# Altium schematic sheet Sheet1.SchDoc
size A2
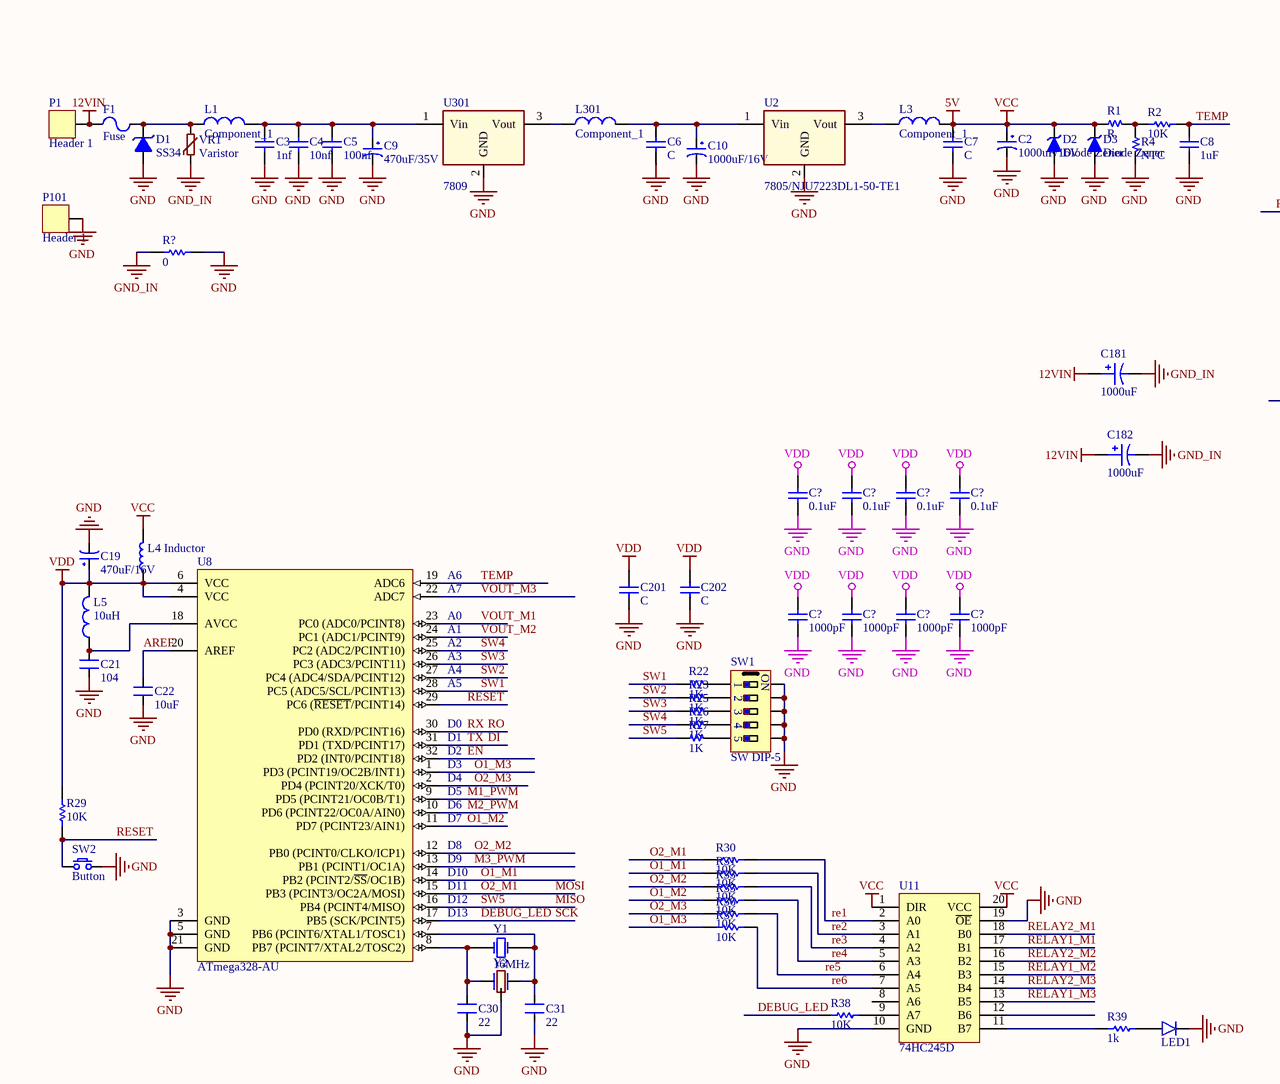
[diagram p0: Sheet1.SchDoc, top left]
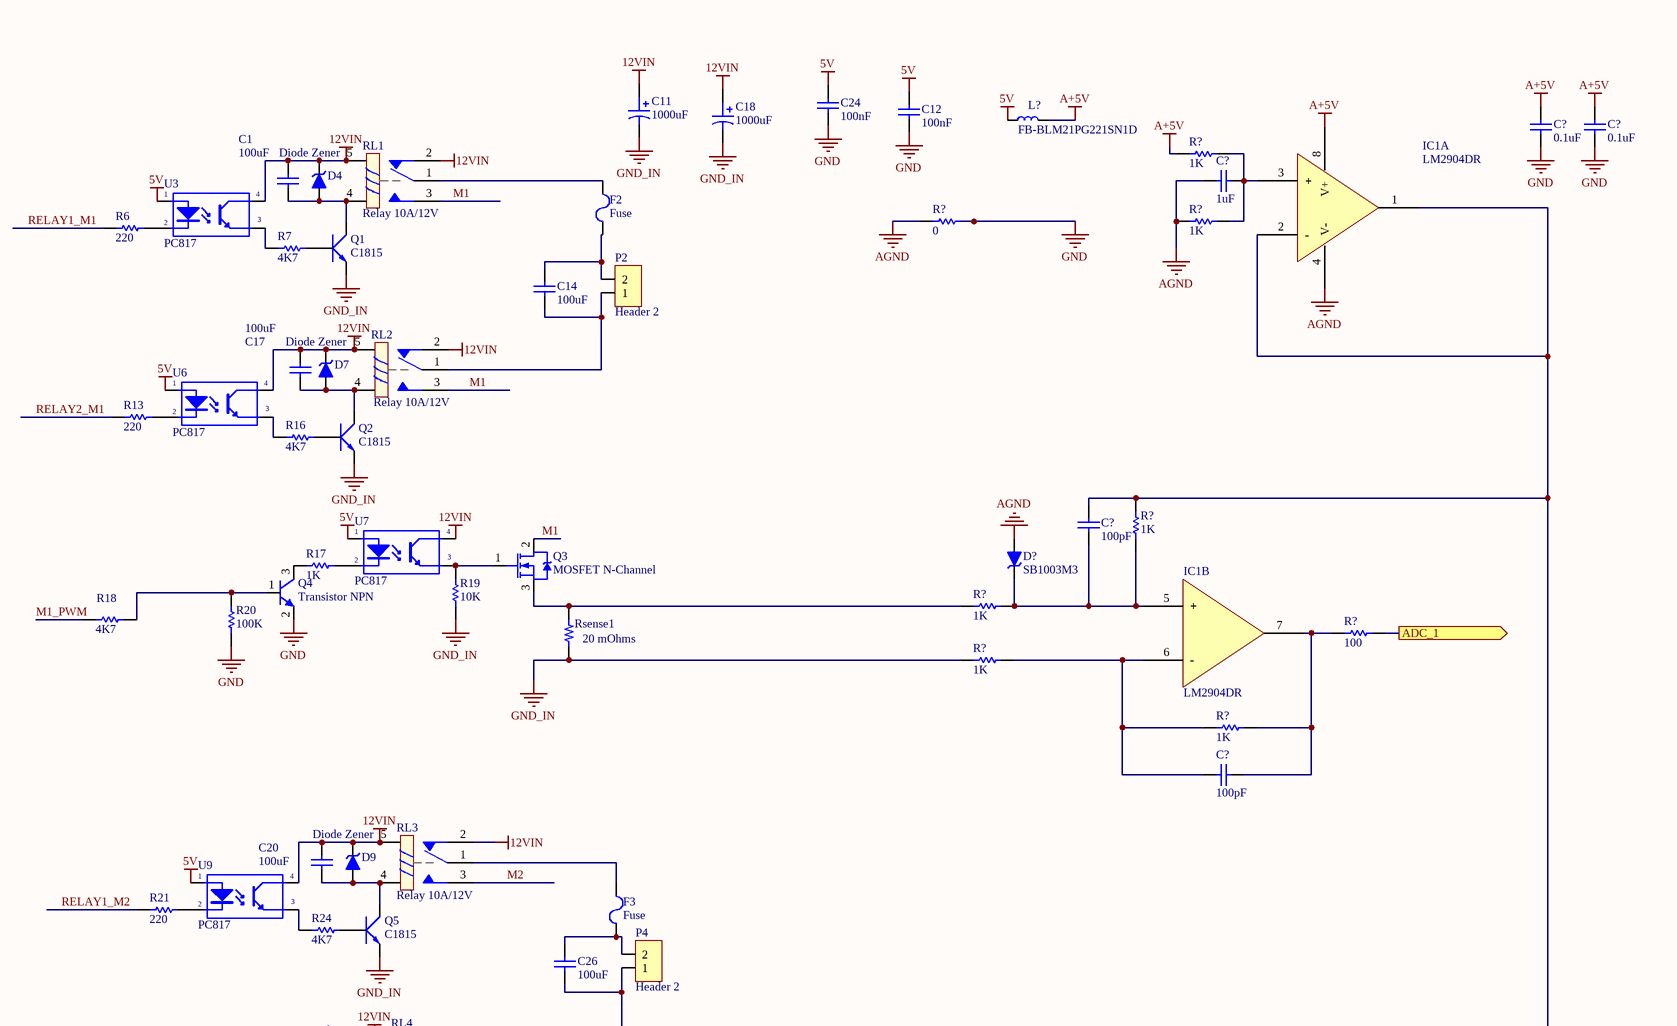
[diagram p1: Sheet1.SchDoc, top right]
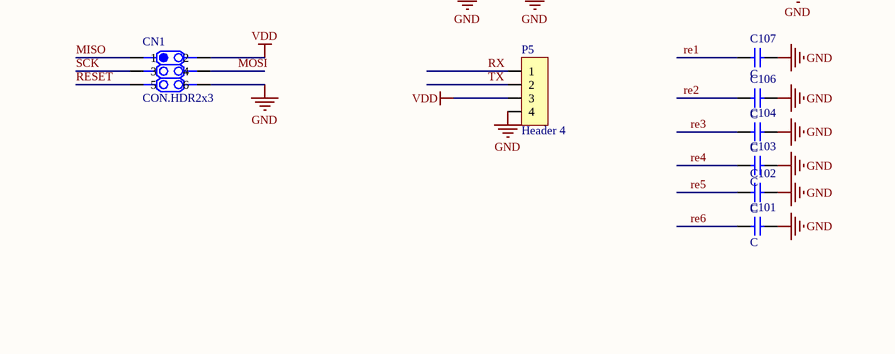
[diagram p2: Sheet1.SchDoc, bottom left]
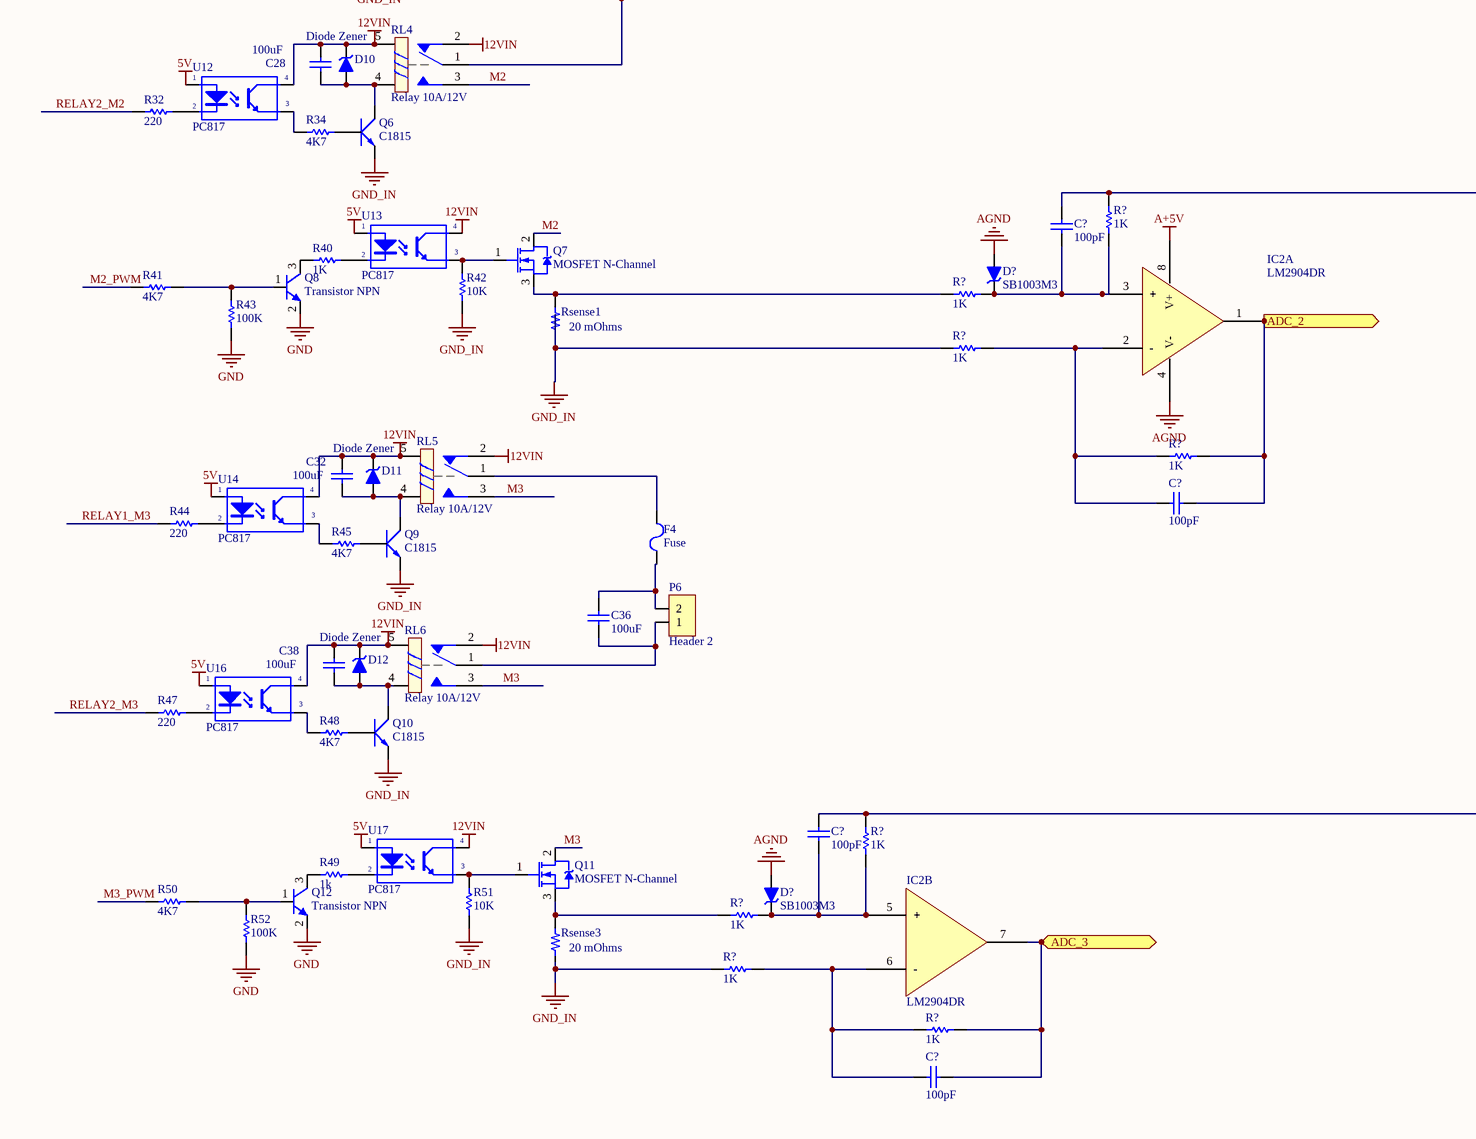
[diagram p3: Sheet1.SchDoc, bottom right]

## Parts
(Parts that share a designator on the sheet are numbered #1, #2 ... from top to bottom, then left to right.)
C1  value 100uF  [C 0805 (2012)]  (hidden comment: Cap Non-pol)
C2  1000uF/16V  [WCAP-PSHP 8x8.7x3.1]
C3  1nf  [C 0805 (2012)]
C4  10nf  [C 0805 (2012)]
C5  100nf  [C 0805 (2012)]
C6  C  [C 0805 (2012)]
C7  C  [C 0805 (2012)]
C8  1uF  [C 0805 (2012)]
C9  470uF/35V  [WCAP-PSHP 8x8.7x3.1]
C10  1000uF/16V  [WCAP-PSHP 8x8.7x3.1]
C11  value 1000uF  [RADIAL E]  (hidden comment: Cap Pol)
C12  value 100nF  [C 0805 (2012)]  (hidden comment: Cap Non-pol)
C14  value 100uF  [Cap Non-Pol 5mm]  (hidden comment: Cap Non-pol)
C17  value 100uF  [C 0805 (2012)]  (hidden comment: Cap Non-pol)
C18  value 1000uF  [RADIAL E]  (hidden comment: Cap Pol)
C19  470uF/16V  [WCAP-PSHP 8x8.7x3.1]
C20  value 100uF  [C 0805 (2012)]  (hidden comment: Cap Non-pol)
C21  104  [R 0805 (2012)]
C22  10uF  [R 0805 (2012)]
C24  value 100nF  [C 0805 (2012)]  (hidden comment: Cap Non-pol)
C26  value 100uF  [Cap Non-Pol 5mm]  (hidden comment: Cap Non-pol)
C28  value 100uF  [C 0805 (2012)]  (hidden comment: Cap Non-pol)
C30  22  [C 0805 (2012)]
C31  22  [C 0805 (2012)]
C32  value 100uF  [C 0805 (2012)]  (hidden comment: Cap Non-pol)
C36  value 100uF  [Cap Non-Pol 5mm]  (hidden comment: Cap Non-pol)
C38  value 100uF  [C 0805 (2012)]  (hidden comment: Cap Non-pol)
C101  C  [C 0805]
C102  C  [C 0805]
C103  C  [C 0805]
C104  C  [C 0805]
C106  C  [C 0805]
C107  C  [C 0805]
C181  value 1000uF  [RADIAL E]  (hidden comment: Cap Pol)
C182  value 1000uF  [RADIAL E]  (hidden comment: Cap Pol)
C201  C  [C 0805 (2012)]
C202  C  [C 0805 (2012)]
C?#1  value 0.1uF  [C 0805 (2012)]  (hidden comment: Cap Non-pol)
C?#2  value 0.1uF  [C 0805 (2012)]  (hidden comment: Cap Non-pol)
C?#3  value 1uF  [C 0805 (2012)]  (hidden comment: Cap Non-pol)
C?#4  0.1uF  [C 0603]
C?#5  0.1uF  [C 0603]
C?#6  0.1uF  [C 0603]
C?#7  0.1uF  [C 0603]
C?#8  value 100pF  [C 0805 (2012)]  (hidden comment: Cap Non-pol)
C?#9  1000pF  [C 0603]
C?#10  1000pF  [C 0603]
C?#11  1000pF  [C 0603]
C?#12  1000pF  [C 0603]
C?#13  value 100pF  [C 0805 (2012)]  (hidden comment: Cap Non-pol)
C?#14  value 100pF  [C 0805 (2012)]  (hidden comment: Cap Non-pol)
C?#15  value 100pF  [C 0805 (2012)]  (hidden comment: Cap Non-pol)
C?#16  value 100pF  [C 0805 (2012)]  (hidden comment: Cap Non-pol)
C?#17  value 100pF  [C 0805 (2012)]  (hidden comment: Cap Non-pol)
CN1  CON.HDR2x3  [Header 3x2]
D1  SS34  [DO-214AC (SMA)]
D2  Diode Zener  [SOD-80]
D3  Diode Zener  [SOD-80]
D4  Diode Zener  [SOD-80]
D7  Diode Zener  [SOD-80]
D9  Diode Zener  [SOD-80]
D10  Diode Zener  [SOD-80]
D11  Diode Zener  [SOD-80]
D12  Diode Zener  [SOD-80]
D?#1  SB1003M3  [DO-214AC (SMA)]
D?#2  SB1003M3  [DO-214AC (SMA)]
D?#3  SB1003M3  [DO-214AC (SMA)]
F1  Fuse  [FUSE 4 DIP]
F2  Fuse  [FUSE 4 DIP]
F3  Fuse  [FUSE 4 DIP]
F4  Fuse  [FUSE 4 DIP]
IC1  LM2904DR  [TI SOIC-8 D]  (parts A,B of 2)
IC2  LM2904DR  [TI SOIC-8 D]  (parts A,B of 2)
L1  Component_1  [1210]
L3  Component_1  [1210]
L4  Inductor  [Inductor SMD 4.8x4.8]
L5  10uH  [R 0805 (2012)]
L301  Component_1  [1210]
L?  FB-BLM21PG221SN1D  [L 0805 (2012)]
LED1  Led  [Led SMD 0805]  (value not drawn)
P1  Header 1  [HDR/Terminal/1/copper/8.8]
P2  Header 2  [HDR Domino 2]
P4  Header 2  [HDR Domino 2]
P5  Header 4  [Header 4]
P6  Header 2  [HDR Domino 2]
P101  Header 1  [HDR/Terminal/1/copper/8.8]
Q1  C1815  [SOT23B]
Q2  C1815  [SOT23B]
Q3  MOSFET N-Channel  [TO-252 (DPAK)]
Q4  Transistor NPN  [SOT-23]
Q5  C1815  [SOT23B]
Q6  C1815  [SOT23B]
Q7  MOSFET N-Channel  [TO-252 (DPAK)]
Q8  Transistor NPN  [SOT-23]
Q9  C1815  [SOT23B]
Q10  C1815  [SOT23B]
Q11  MOSFET N-Channel  [TO-252 (DPAK)]
Q12  Transistor NPN  [SOT-23]
R1  R  [R 0805]
R2  10K  [R 0805 (2012)]
R4  NTC  [R 1/4W/300]
R6  220  [R 0805 (2012)]
R7  4K7  [R 0805 (2012)]
R13  220  [R 0805 (2012)]
R16  4K7  [R 0805 (2012)]
R17  1K  [R 0805 (2012)]
R18  4K7  [R 0805 (2012)]
R19  10K  [R 0805 (2012)]
R20  100K  [R 0805 (2012)]
R21  220  [R 0805 (2012)]
R22  1K  [R 0805]
R23  1K  [R 0805]
R24  4K7  [R 0805 (2012)]
R25  1K  [R 0805]
R26  1K  [R 0805]
R27  1K  [R 0805]
R29  10K  [R 0805 (2012)]
R30  10K  [R 0805 (2012)]
R31  10K  [R 0805 (2012)]
R32  220  [R 0805 (2012)]
R33  10K  [R 0805 (2012)]
R34  4K7  [R 0805 (2012)]
R35  10K  [R 0805 (2012)]
R36  10K  [R 0805 (2012)]
R37  10K  [R 0805 (2012)]
R38  10K  [R 0805 (2012)]
R39  1k  [R 0805 (2012)]
R40  1K  [R 0805 (2012)]
R41  4K7  [R 0805 (2012)]
R42  10K  [R 0805 (2012)]
R43  100K  [R 0805 (2012)]
R44  220  [R 0805 (2012)]
R45  4K7  [R 0805 (2012)]
R47  220  [R 0805 (2012)]
R48  4K7  [R 0805 (2012)]
R49  1k  [R 0805 (2012)]
R50  4K7  [R 0805 (2012)]
R51  10K  [R 0805 (2012)]
R52  100K  [R 0805 (2012)]
R?#1  1K  [R 0805 (2012)]
R?#2  0  [R 0805 (2012)]
R?#3  1K  [R 0805 (2012)]
R?#4  0  [R 0805 (2012)]
R?#5  1K  [R 0805 (2012)]
R?#6  1K  [R 0805 (2012)]
R?#7  100  [R 0805 (2012)]
R?#8  1K  [R 0805 (2012)]
R?#9  1K  [R 0805 (2012)]
R?#10  1K  [R 0805 (2012)]
R?#11  1K  [R 0805 (2012)]
R?#12  1K  [R 0805 (2012)]
R?#13  1K  [R 0805 (2012)]
R?#14  1K  [R 0805 (2012)]
R?#15  1K  [R 0805 (2012)]
R?#16  1K  [R 0805 (2012)]
R?#17  1K  [R 0805 (2012)]
RL1  Relay 10A/12V  [RL_SPDT_10A]
RL2  Relay 10A/12V  [RL_SPDT_10A]
RL3  Relay 10A/12V  [RL_SPDT_10A]
RL4  Relay 10A/12V  [RL_SPDT_10A]
RL5  Relay 10A/12V  [RL_SPDT_10A]
RL6  Relay 10A/12V  [RL_SPDT_10A]
Rsense1#1  20 mOhms  [VISHAY WSHP2818]
Rsense1#2  20 mOhms  [VISHAY WSHP2818]
Rsense3  20 mOhms  [VISHAY WSHP2818]
SW1  SW DIP-5  [SW/DIP5/300]
SW2  Button  [SW/2/SMD]
U2  7805/NJU7223DL1-50-TE1  [TO-252 (DPAK)]
U3  PC817  [SOP4 - PC817]
U6  PC817  [SOP4 - PC817]
U7  PC817  [SOP4 - PC817]
U8  ATmega328-AU  [QFP32N]
U9  PC817  [SOP4 - PC817]
U11  74HC245D  [SOIC-20]
U12  PC817  [SOP4 - PC817]
U13  PC817  [SOP4 - PC817]
U14  PC817  [SOP4 - PC817]
U16  PC817  [SOP4 - PC817]
U17  PC817  [SOP4 - PC817]
U301  7809  [TO-252 (DPAK)]
VR1  Varistor  [VARISTOR DISC 5MM/7MM]
Y1  16MHz  [XTAL]
Y2  (no value)  [Crystal SMD CSTCE]

## Ports
ADC_1 (out), ADC_2 (out), ADC_3 (out)

## Nets
5V: C2.1 C7.1 C12.2 C24.2 D2.2(K) D3.2(K) L3.2 L4.2 L?.1 R1.1 U3.1(A) U6.1(A) U7.1(A) U9.1(A) U11.1(DIR) U11.20(VCC) U12.1(A) U13.1(A) U14.1(A) U16.1(A) U17.1(A)  [also labelled VCC]
12VIN: C1.2 C11.1 C17.2 C18.1 C20.2 C28.2 C32.2 C38.2 C181.1 C182.1 D4.2(K) D7.2(K) D9.2(K) D10.2(K) D11.2(K) D12.2(K) F1.1 P1.1 RL1.2 RL1.5 RL2.2 RL2.5 RL3.2 RL3.5 RL4.2 RL4.5 RL5.2 RL5.5 RL6.2 RL6.5 U3.4(C) U6.4(C) U7.4(C) U9.4(C) U12.4(C) U13.4(C) U14.4(C) U16.4(C) U17.4(C)
A+5V: C?#1.2 C?#2.2 IC1.8(V+) IC2.8(V+) L?.2 R?#1.1
AGND: C?#3.2 D?#1.1(A) D?#2.1(A) D?#3.1(A) IC1.4(V-) IC2.4(V-) R?#2.1 R?#3.1
GND: C2.2 C3.2 C4.2 C5.2 C6.2 C7.2 C8.2 C9.2 C10.2 C12.1 C19.2 C21.1 C22.1 C24.1 C30.1 C31.1 C101.2 C102.2 C103.2 C104.2 C106.2 C107.2 C201.2 C202.2 C?#1.1 C?#2.1 C?#4.2 C?#5.2 C?#6.2 C?#7.2 C?#9.2 C?#10.2 C?#11.2 C?#12.2 CN1.6 D1.1(A) D2.1(A) D3.1(A) LED1.2(K) P5.4 P101.1 Q4.2(E) Q8.2(E) Q12.2(E) R4.2 R20.1 R43.1 R52.1 R?#2.2 R?#4.1 SW1.6 SW1.7 SW1.8 SW1.9 SW1.10 SW2.2 U2.2(GND) U8.3(GND) U8.5(GND) U8.21(GND) U11.10(GND) U11.19(~{OE}) U301.2(GND) Y2.2
GND_IN: C11.2 C18.2 C181.2 C182.2 Q1.1(E) Q2.1(E) Q5.1(E) Q6.1(E) Q9.1(E) Q10.1(E) R19.1 R42.2 R51.2 R?#4.2 R?#8.2 R?#12.2 R?#16.2 Rsense1#1.1 Rsense1#2.1 Rsense3.1 VR1.2
VDD: C19.1 C201.1 C202.1 C?#4.1 C?#5.1 C?#6.1 C?#7.1 C?#9.1 C?#10.1 C?#11.1 C?#12.1 CN1.2 L4.1 L5.2 P5.3 R29.2 U8.4(VCC) U8.6(VCC)
ADC_1: R?#7.1 ; port ADC_1
ADC_2: C?#15.1 IC2.1(OUTA) R?#13.1 ; port ADC_2
ADC_3: C?#17.1 IC2.7(OUTB) R?#17.1 ; port ADC_3
AREF: C22.2 U8.20(AREF)
DEBUG_LED: CN1.3 R38.1 U8.17(PB5_(SCK/PCINT5))  [also labelled SCK]
DI: P5.2 U8.31(PD1_(TXD/PCINT17))  [also labelled TX]
EN: U8.32(PD2_(INT0/PCINT18))
M1: Q3.2(D) RL1.3 RL2.3
M1_PWM: R18.2 U8.9(PD5_(PCINT21/OC0B/T1))
M2: Q7.2(D) RL3.3 RL4.3
M2_PWM: R41.2 U8.10(PD6_(PCINT22/OC0A/AIN0))
M3: Q11.2(D) RL5.3 RL6.3
M3_PWM: R50.2 U8.13(PB1_(PCINT1/OC1A))
MISO: CN1.1 R27.1 U8.16(PB4_(PCINT4/MISO))  [also labelled SW5]
MOSI: CN1.4 R30.1 U8.15(PB3_(PCINT3/OC2A/MOSI))  [also labelled O2_M1]
O1_M1: R31.1 U8.14(PB2_(PCINT2/~{SS}/OC1B))
O1_M2: R35.1 U8.11(PD7_(PCINT23/AIN1))
O1_M3: R37.1 U8.1(PD3_(PCINT19/OC2B/INT1))
O2_M2: R33.1 U8.12(PB0_(PCINT0/CLKO/ICP1))
O2_M3: R36.1 U8.2(PD4_(PCINT20/XCK/T0))
re1: C107.1 R30.2 U11.2(A0)
re2: C106.1 R31.2 U11.3(A1)
re3: C104.1 R33.2 U11.4(A2)
re4: C103.1 R35.2 U11.5(A3)
re5: C102.1 R36.2 U11.6(A4)
re6: C101.1 R37.2 U11.7(A5)
RELAY1_M1: R6.2 U11.17(B1)
RELAY1_M2: R21.2 U11.15(B3)
RELAY1_M3: R44.2 U11.13(B5)
RELAY2_M1: R13.2 U11.18(B0)
RELAY2_M2: R32.2 U11.16(B2)
RELAY2_M3: R47.2 U11.14(B4)
RESET: CN1.5 R29.1 SW2.1 U8.29(PC6_(~{RESET}/PCINT14))
RO: P5.1 U8.30(PD0_(RXD/PCINT16))  [also labelled RX]
SW1: R22.1 U8.28(PC5_(ADC5/SCL/PCINT13))
SW2: R23.1 U8.27(PC4_(ADC4/SDA/PCINT12))
SW3: R25.1 U8.26(PC3_(ADC3/PCINT11))
SW4: R26.1 U8.25(PC2_(ADC2/PCINT10))
TEMP: C8.1 R2.2 U8.19(ADC6)
VOUT_M1: U8.23(PC0_(ADC0/PCINT8))
VOUT_M2: U8.24(PC1_(ADC1/PCINT9))
VOUT_M3: U8.22(ADC7)
NetC1_1: C1.1 D4.1(A) Q1.2(C) RL1.4
NetC3_1: C3.1 C4.1 C5.1 C9.1 L1.2 U301.1(Vin)
NetC6_1: C6.1 C10.1 L301.2 U2.1(Vin)
NetC14_1: C14.1 P2.1 RL2.1
NetC14_2: C14.2 F2.1 P2.2
NetC17_1: C17.1 D7.1(A) Q2.2(C) RL2.4
NetC20_1: C20.1 D9.1(A) Q5.2(C) RL3.4
NetC21_2: C21.2 L5.1 U8.18(AVCC)
NetC26_1: C26.1 P4.1 RL4.1
NetC26_2: C26.2 F3.1 P4.2
NetC28_1: C28.1 D10.1(A) Q6.2(C) RL4.4
NetC30_2: C30.2 U8.8(PB7_(PCINT7/XTAL2/TOSC2)) Y1.1(OSC1) Y2.3
NetC31_2: C31.2 U8.7(PB6_(PCINT6/XTAL1/TOSC1)) Y1.2(OSC2) Y2.1
NetC32_1: C32.1 D11.1(A) Q9.2(C) RL5.4
NetC36_1: C36.1 P6.1 RL6.1
NetC36_2: C36.2 F4.1 P6.2
NetC38_1: C38.1 D12.1(A) Q10.2(C) RL6.4
NetC?#3_1: C?#3.1 IC1.3(+) R?#1.2 R?#3.2
NetC?#8_1: C?#8.1 C?#14.1 C?#16.1 IC1.1(OUTA) IC1.2(-) R?#5.1 R?#10.1 R?#14.1
NetC?#8_2: C?#8.2 D?#1.2(K) IC1.5(+) R?#5.2 R?#6.1
NetC?#13_1: C?#13.1 IC1.7(OUTB) R?#7.2 R?#9.1
NetC?#13_2: C?#13.2 IC1.6(-) R?#8.1 R?#9.2
NetC?#14_2: C?#14.2 D?#2.2(K) IC2.3(+) R?#10.2 R?#11.1
NetC?#15_2: C?#15.2 IC2.2(-) R?#12.1 R?#13.2
NetC?#16_2: C?#16.2 D?#3.2(K) IC2.5(+) R?#14.2 R?#15.1
NetC?#17_2: C?#17.2 IC2.6(-) R?#16.1 R?#17.2
NetD1_2: D1.2(K) F1.2 L1.1 VR1.1
NetF2_2: F2.2 RL1.1
NetF3_2: F3.2 RL3.1
NetF4_2: F4.2 RL5.1
NetL3_1: L3.1 U2.3(Vout)
NetL301_1: L301.1 U301.3(Vout)
NetLED1_1: LED1.1(A) R39.2
NetQ1_3: Q1.3(B) R7.2
NetQ2_3: Q2.3(B) R16.2
NetQ3_1: Q3.1(G) R19.2 U7.3(E)
NetQ3_3: Q3.3(S) R?#6.2 Rsense1#1.2
NetQ4_1: Q4.1(B) R18.1 R20.2
NetQ4_3: Q4.3(C) R17.1
NetQ5_3: Q5.3(B) R24.2
NetQ6_3: Q6.3(B) R34.2
NetQ7_1: Q7.1(G) R42.1 U13.3(E)
NetQ7_3: Q7.3(S) R?#11.2 Rsense1#2.2
NetQ8_1: Q8.1(B) R41.1 R43.2
NetQ8_3: Q8.3(C) R40.1
NetQ9_3: Q9.3(B) R45.2
NetQ10_3: Q10.3(B) R48.2
NetQ11_1: Q11.1(G) R51.1 U17.3(E)
NetQ11_3: Q11.3(S) R?#15.2 Rsense3.2
NetQ12_1: Q12.1(B) R50.1 R52.2
NetQ12_3: Q12.3(C) R49.1
NetR1_2: R1.2 R2.1 R4.1
NetR6_1: R6.1 U3.2(K)
NetR7_1: R7.1 U3.3(E)
NetR13_1: R13.1 U6.2(K)
NetR16_1: R16.1 U6.3(E)
NetR17_2: R17.2 U7.2(K)
NetR21_1: R21.1 U9.2(K)
NetR22_2: R22.2 SW1.1
NetR23_2: R23.2 SW1.2
NetR24_1: R24.1 U9.3(E)
NetR25_2: R25.2 SW1.3
NetR26_2: R26.2 SW1.4
NetR27_2: R27.2 SW1.5
NetR32_1: R32.1 U12.2(K)
NetR34_1: R34.1 U12.3(E)
NetR38_2: R38.2 U11.9(A7)
NetR39_1: R39.1 U11.11(B7)
NetR40_2: R40.2 U13.2(K)
NetR44_1: R44.1 U14.2(K)
NetR45_1: R45.1 U14.3(E)
NetR47_1: R47.1 U16.2(K)
NetR48_1: R48.1 U16.3(E)
NetR49_2: R49.2 U17.2(K)

Not connected (* = marked no-connect by the designer): U11 8(A6) 12(B6)

## Notes on the sheet
- (near U8) A6
- (near U8) A7
- (near U8) A0
- (near U8) A1
- (near U8) A2
- (near U8) A3
- (near U8) A4
- (near U8) A5
- (near U8) D0
- (near U8) D2
- (near U8) D3
- (near U8) D4
- (near U8) D5
- (near U8) D1
- (near U8) D7
- (near U8) D8
- (near U8) D9
- (near U8) D6
- (near U8) D10
- (near U8) D11
- D12
- D13
- (in symbol SW DIP-5) ON

## Library data of the parts
C1 C12 C14 C17 C20 C24 C26 C28 C32 C36 C38 C?#1-C?#3 C?#8 C?#13-C?#17 = Cap Non-pol: Non-polarized Capacitor; Published: 8-Jun-2000; LatestRevisionDate: 17-Jul-2002; LatestRevisionNote: Re-released for DXP Platform.; PackageReference: RAD-0.3; Publisher: Altium Limited
C2 C10 C19 = CP4: Cap 1000uF/16V - 220uF/50V; Description 5: 4,7uF>10uF/250V_3,3uF>10uF/400V - 2,2uF>4,7uF/450V; Description 1: 2200uF-3300uF/6,3V - 1000uF-2200uF/10V; Description 2: 1000uF/16V - 470uF => 1000uF/25V - 100uF/100V; Description 3: 330uF>470uF/35V_220uF>470uF/50V_10uF>22uF/250V; Description 4: 220uF => 330uF/63V - 10uF =>33uF/160 - 200V; Value: 1000uF/16V
C3-C8 C101-C104 C106 C107 C201 C202 = Capacitor NP: Capacitor non-pol
C9 = CP3: Cap 100uF/35V - 470uF/16V; Value: 100uF/35V/50V; Description 1: 1000uF/6,3V - 470uF/16V - 330uF - 25V; Description 2: 220uF/35V - 100uF/50V - 63V - 4,7uF/200V; Description 3: 22uF => 33uF100V - 3,3uF => 4,7uF/250V; Description 4: 2,2uF =>3,3uF/350 - 2,2uF/400V - 1uF/450V
C11 C18 C181 C182 = Cap Pol: Polarized Capacitor; Published: 8-Jun-2000; LatestRevisionDate: 17-Jul-2002; LatestRevisionNote: Re-released for DXP Platform.; PackageReference: POLAR0.8; Publisher: Altium Limited
C21 C30 C31 = CN2: Cap np 104 => 105pF; Value: 0.1uF
C22 = CN1: Cap np  1pF - 472pF; Value: 100pF
C?#4-C?#7 C?#9-C?#12 = Capacitor NP: CAP CER 0.1UF 50V X7R 0603; TYPE: SMD; PACKAGE: SMD0603; STOCK CODE: CC0603KRX7R9BB104; SUPPLIER: tme.vn; STOCK DESC: 100nF/50V ±10% X7R SMD-0603 Capacitor; UNIT PRICE: 400
CN1 = CON.HDR2x3: Header 2x3; Publisher: Hoang Nguyen; ComponentLink1Description: Digikey Part link; ComponentLink2Description: Open DataSheet; ComponentLink2URL: H:\LIBRARY\LIBRARY.Datasheet\
D1 = Zener
D2-D4 D7 D9-D12 D?#1-D?#3 = Diode Zener: Zener Diode
  D2-D4 D7 D9-D12: Published: 8-Jun-2000; LatestRevisionDate: 17-Jul-2002; LatestRevisionNote: Re-released for DXP Platform.; PackageReference: DIODE-0.7; Publisher: Altium Limited
IC1 IC2 = LM2904DR: IC OPAMP GP 2 CIRCUIT 8SOIC; Manufacturer: Texas Instruments; Amplifier Type: General Purpose; Current - Input Bias: 20nA; Current - Output / Channel: 30mA; Current - Supply: 1mA; Gain Bandwidth Product: 700kHz; Number of Circuits: 2; Slew Rate: 0.3V/µs; Voltage - Input Offset: 3mV; Voltage - Supply, Single/Dual (±): 3V ~ 26V, ±1.5V ~ 13V; Part Number: LM2904DR; ComponentLink1Description: Datasheet; ComponentLink1URL: http://www.ti.com/general/docs/suppproductinfo.tsp?distId=10&gotoUrl=http%3A%2F%2Fwww.ti.com%2Flit%2Fgpn%2Flm258a; ComponentLink2Description: DigiKey Link; ComponentLink2URL: http://digikey.com/product-detail/en/texas-instruments/LM2904DR/296-14596-1-ND/555533; Device Package: 8-SOIC (0.154", 3.90mm Width); LastUpdated: 1/9/2020 2:06:28 AM; Lifecycle Status: Active; Minimum Order: 1; Mounting Type: Surface Mount; Operating Temperature: -40°C ~ 125°C; Package / Case: 8-SOIC (0.154", 3.90mm Width); Packaging: ReReel; PartId: 4; Part Status: Active; Price: 0.00; Series: -; Supplier 1: DigiKey; Supplier Part Number 1: 296-14596-1-ND; Supplier Device Package: 8-SOIC
L5 = L1: Inductor; Value: 150 mH
L? = Inductor
LED1 = Led: Typical LED
P1 P101 = Header 1: Header, 1-Pin
P2 P4 P6 = Header 2: Header, 2-Pin; LatestRevisionDate: 17-Jul-2002; LatestRevisionNote: Re-released for DXP Platform.; Publisher: Altium Limited
P5 = Header 4: Header, 4-Pin
Q1 Q2 Q5 Q6 Q9 Q10 = C1815: NPN 600mW, ECB; Value: C1815
Q4 Q8 Q12 = Transistor NPN: NPN Bipolar Transistor
R1 R2 R4 R6 R7 R13 R16-R27 R29-R45 R47-R52 R?#1-R?#17 = Resistor
  R2 R6 R7 R13 R16-R21 R24 R30-R45 R47-R52 R?#1-R?#17: Published: 8-Jun-2000; LatestRevisionDate: 17-Jul-2002; LatestRevisionNote: Re-released for DXP Platform.; PackageReference: AXIAL-0.3; Publisher: Altium Limited
  R29: Published: 8-Jun-2000; LatestRevisionDate: 17-Jul-2002; LatestRevisionNote: Re-released for DXP Platform.; PackageReference: AXIAL-0.3; Publisher: Altium Limited; Value: 10K
RL1-RL6 = Relay 1: Relay SPDT,10A - 12VDC 5 Pin; Value: Relay SPDT, 10A, 12V
Rsense1#1 Rsense1#2 Rsense3 = WSHP2818R0200FEA: RES 0.02 OHM 1% 10W 2818; Manufacturer: Vishay Dale; Temperature Coefficient: ±75ppm/°C; Part Number: WSHP2818R0200FEA; Package / Case: Nonstandard; ComponentLink1Description: Datasheet; ComponentLink1URL: http://www.vishay.com/docs/30347/wshp2818.pdf; ComponentLink2Description: DigiKey Link; ComponentLink2URL: http://digikey.com/product-detail/en/vishay-dale/WSHP2818R0200FEA/541-3277-1-ND/6605253; Composition: Metal Element; Device Package: Nonstandard; Features: Automotive AEC-Q200, Current Sense, Moisture Resistant, Pulse Withstanding; Height - Seated (Max): 0.069" (1.75mm); LastUpdated: 2/4/2020 3:03:01 AM; Lifecycle Status: Active; Minimum Order: 1; Number of Terminations: 2; Operating Temperature: -65°C ~ 170°C; Packaging: TapeAndReel; PartId: 2687; Part Status: Active; Power (Watts): 10W; Price: 0.62; Ratings: AEC-Q200; Resistance: 20 mOhms; Series: WSHP2818; Size / Dimension: 0.280" L x 0.181" W (7.10mm x 4.60mm); Supplier 1: DigiKey; Supplier Part Number 1: 541-3277-1-ND; Supplier Device Package: 2818; Tolerance: ±1%; Value: 20 mOhms
SW2 = SW SPST: Tact switch 2 pin
U2 U301 = 78xx: LDO Fixed Voltage regulator
U3 U6 U7 U9 U12-U14 U16 U17 = PC817: Single Opto; Value: PC817
U8 = ATmega328-AU: 8-bit AVR Microcontroller, 32KB Flash, 1KB EEPROM, 2KB SRAM, 32-pin TQFP, Industrial Grade (-40°C to 85°C); Published: 1-Apr-2010; DatasheetVersion: revA, Jan-2010; PackageVersion: revB, Oct-2001; PackageReference: 32A; Publisher: Altium Limited; PackageDescription: 32-Lead, 7x7x1.0 mm Body, 0.8mm Lead Pitch, Thin Profile Plastic Quad Flat Package (TQFP); Supplier 1: Digi-Key; Supplier Part Number 1: ATMEGA328-AU-ND; Supplier 2: Mouser; Supplier Part Number 2: 556-ATMEGA328-AU; Code_JEDEC: MS-026-ABA; ComponentLink1Description: Manufacturer Link; ComponentLink1URL: http://www.atmel.com/products/avr/default.asp?; ComponentLink2Description: ATmega48A/48PA/88A/88PA/168A/168PA/328/328P Datasheet; ComponentLink2URL: http://www.atmel.com/dyn/resources/prod_documents/8271.pdf; ComponentLink3Description: ATmega48A/48PA/88A/88PA/168A/168PA/328/328P Summary; ComponentLink3URL: http://www.atmel.com/dyn/resources/prod_documents/8271S.pdf; ComponentLink4Description: Atmel.com Home; ComponentLink4URL: http://www.atmel.com
U11 = 74HC245D: IC TRANSCVR NON-INVERT 6V 20SO
Y1 = XTAL: Crystal Oscillator; Published: 8-Jun-2000; LatestRevisionDate: 17-Jul-2002; LatestRevisionNote: Re-released for DXP Platform.; PackageReference: R38; Publisher: Altium Limited
Y2 = Crystal CSTCE